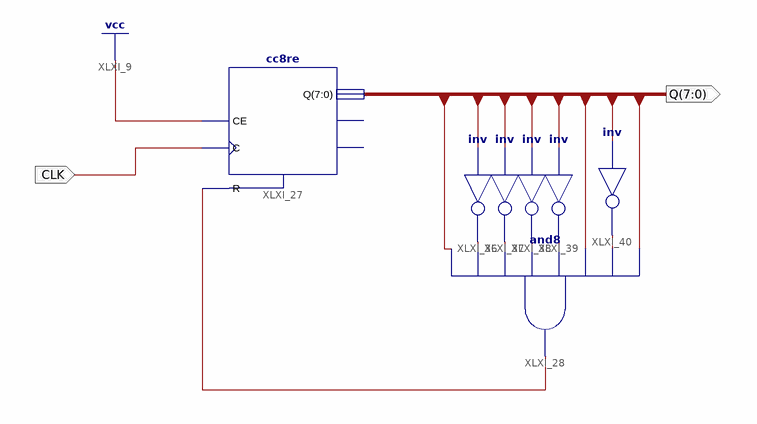
[diagram p0: schematic sheet 1]
// Xilinx ISE schematic counter.sch (spartan3a) as structural Verilog: 7 symbols, 2 ports
module counter (
  input  CLK,
  output [7:0] Q
);

  wire XLXN_149, XLXN_153, XLXN_154, XLXN_157, XLXN_158, XLXN_162;

  cc8re XLXI_27 (.C(CLK), .CE(1'b1), .R(XLXN_158), .Q(Q));  // open: CEO, TC
  and XLXI_28 (XLXN_158, Q[0], XLXN_149, XLXN_162, XLXN_153, XLXN_154, Q[5], XLXN_157, Q[7]);
  not XLXI_36 (XLXN_149, Q[1]);
  not XLXI_37 (XLXN_162, Q[2]);
  not XLXI_38 (XLXN_153, Q[3]);
  not XLXI_39 (XLXN_154, Q[4]);
  not XLXI_40 (XLXN_157, Q[6]);
endmodule
